# EAGLE design Nodo_actuador_doble (EAGLE 6.5.0)
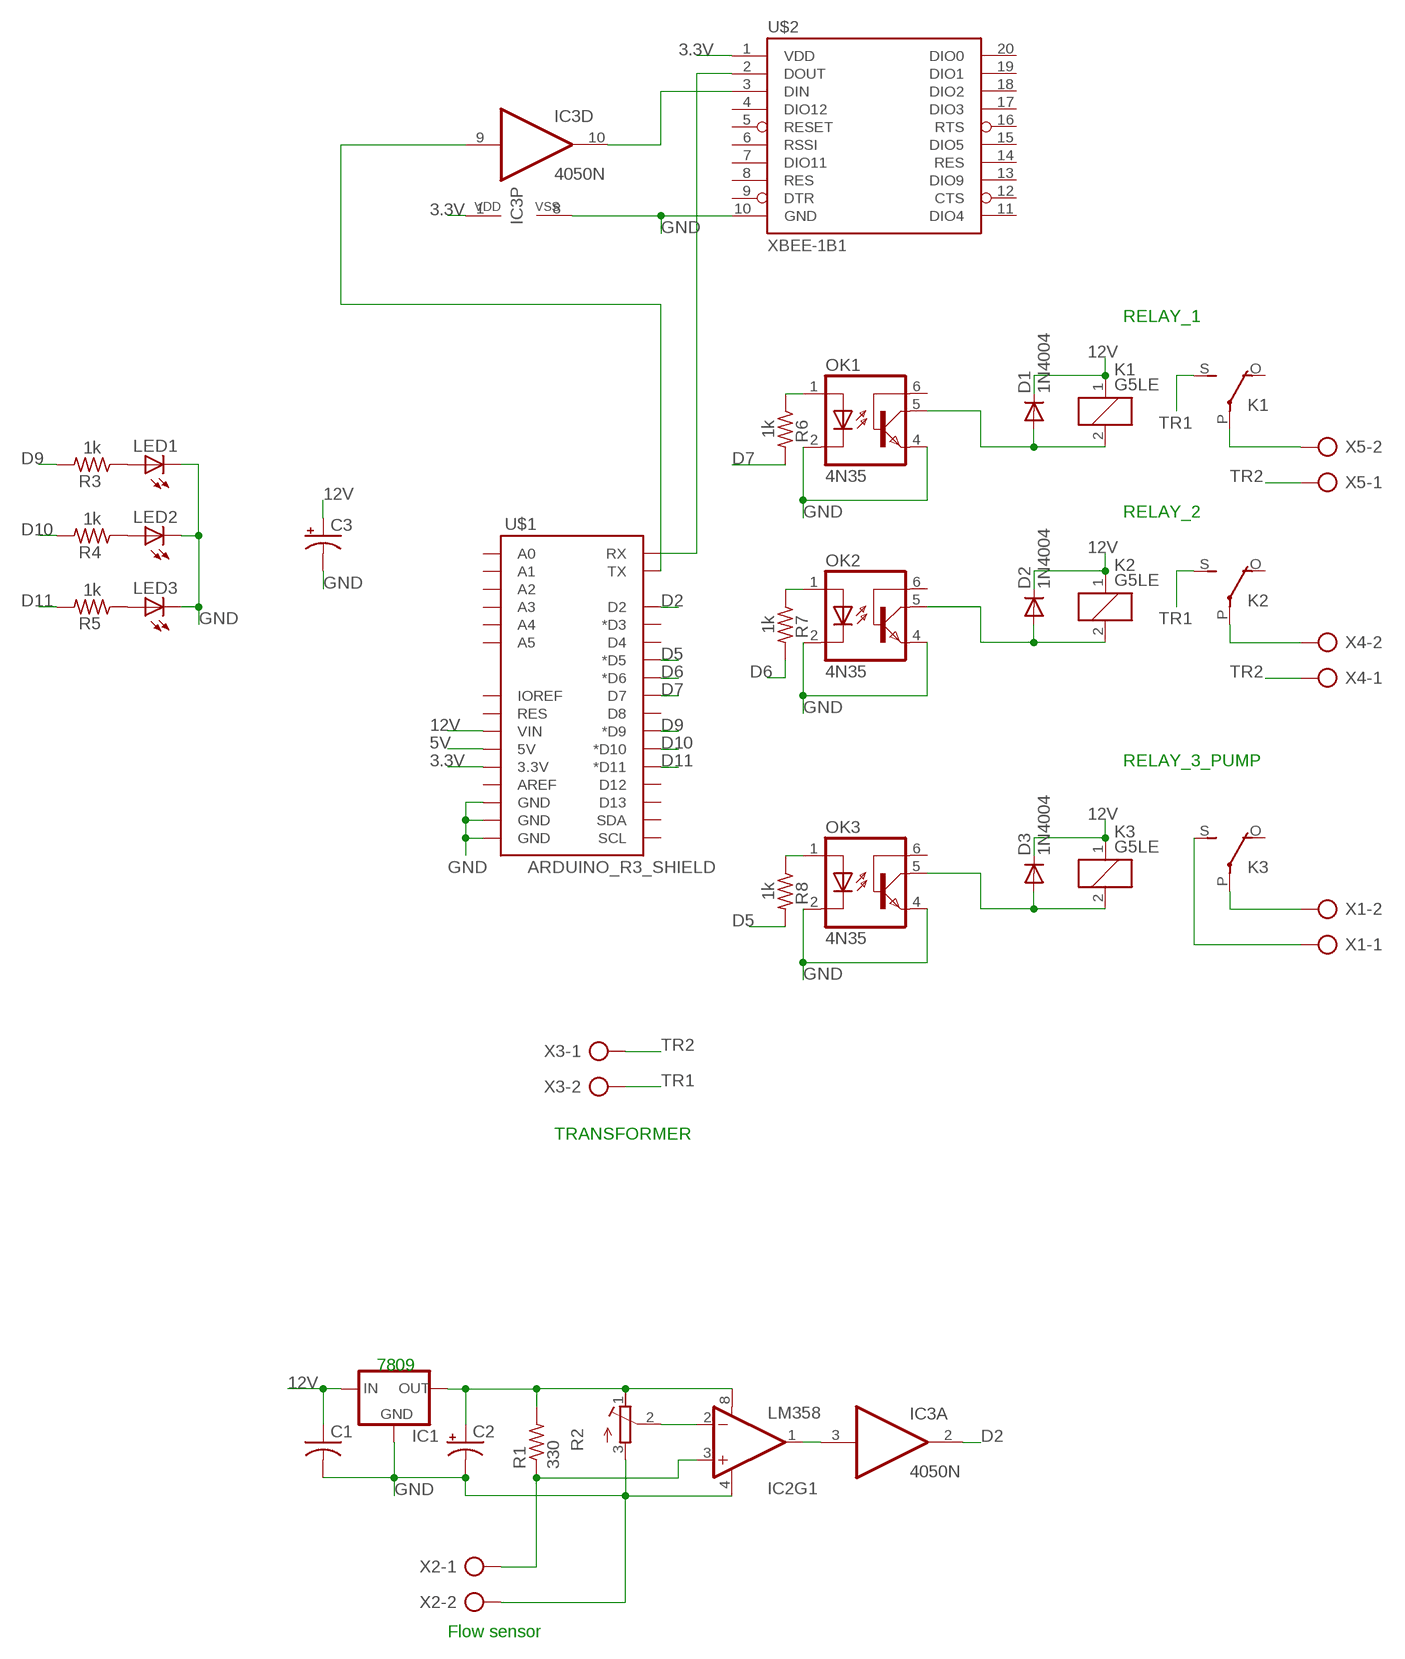
[diagram p0: schematic, sheet 1]

## Parts
C1  C-US050-024X044  [C050-024X044]
C2  CPOL-USE2.5-6  [E2,5-6]
C3  CPOL-USE2.5-6  [E2,5-6]
D1  1N4004  [DO41-10]
D2  1N4004  [DO41-10]
D3  1N4004  [DO41-10]
IC1  78XXS  [78XXS]
IC2  LM358  [DIP08]
IC3  4050N  [DIL16]
K1  G5LE  [G5LE]
K2  G5LE  [G5LE]
K3  G5LE  [G5LE]
LED1  LED3MM  [LED3MM]
LED2  LED3MM  [LED3MM]
LED3  LED3MM  [LED3MM]
OK1  4N35  [DIL06]
OK2  4N35  [DIL06]
OK3  4N35  [DIL06]
R1  330  R-US_0204/7  [0204/7]
R2  R-TRIMMT93YA  [RTRIMT93YA]
R3  1k  R-US_0204/7  [0204/7]
R4  1k  R-US_0204/7  [0204/7]
R5  1k  R-US_0204/7  [0204/7]
R6  1k  R-US_0204/7  [0204/7]
R7  1k  R-US_0204/7  [0204/7]
R8  1k  R-US_0204/7  [0204/7]
U$1  ARDUINO_R3_SHIELD  [UNO_R3_SHIELD]
U$2  XBEE-1B1  [XBEE-1]
X1  AK500/2  [AK500/2]
X2  AK500/2  [AK500/2]
X3  AK500/2  [AK500/2]
X4  AK500/2  [AK500/2]
X5  AK500/2  [AK500/2]

## Nets
3.3V: IC3.1(P:VDD) U$1.3.3V U$2.1(VDD)
5V: U$1.5V
12V: C1.1 C3.+ D1.C D2.C D3.C IC1.IN K1.1 K2.1 K3.1 U$1.VIN
D2: IC3.2(A:O) U$1.D2
D5: R8.2 U$1.D5(*D5)
D6: R7.2 U$1.D6(*D6)
D7: R6.2 U$1.D7
D9: R3.2 U$1.D9(*D9)
D10: R4.2 U$1.D10(*D10)
D11: R5.2 U$1.D11(*D11)
GND: C1.2 C2.- C3.- IC1.GND IC2.4(V-) IC3.8(P:VSS) LED1.K(C) LED2.K(C) LED3.K(C) OK1.2(C) OK1.4(EMI) OK2.2(C) OK2.4(EMI) OK3.2(C) OK3.4(EMI) R2.3(E) U$1.GND@0(GND) U$1.GND@1(GND) U$1.GND@2(GND) U$2.10(GND) X2.2
N$1: LED1.A R3.1
N$2: LED2.A R4.1
N$3: LED3.A R5.1
N$4: IC2.3(+IN) R1.1 X2.1
N$5: C2.+ IC1.OUT IC2.8(V+) R1.2 R2.1(A)
N$6: IC2.1(OUT) IC3.3(A:I)
N$7: IC2.2(-IN) R2.2(S)
N$10: K1.P(2:P) X5.2
N$11: D1.A K1.2 OK1.5(COL)
N$12: K2.P(2:P) X4.2
N$13: D2.A K2.2 OK2.5(COL)
N$14: U$1.RX U$2.2(DOUT)
N$15: IC3.9(D:I) U$1.TX
N$16: IC3.10(D:O) U$2.3(DIN)
N$18: D3.A K3.2 OK3.5(COL)
N$19: K3.P(2:P) X1.2
N$20: K3.S(2:S) X1.1
N$21: OK1.1(A) R6.1
N$22: OK2.1(A) R7.1
N$23: OK3.1(A) R8.1
TR1: K1.S(2:S) K2.S(2:S) X3.2
TR2: X3.1 X4.1 X5.1
Unconnected: IC2.5(+IN) IC2.6(-IN) IC2.7(OUT) IC3.4(B:O) IC3.5(B:I) IC3.6(C:O) IC3.7(C:I) IC3.11(E:I) IC3.12(E:O) IC3.14(F:I) IC3.15(F:O) K1.O(2:O) K2.O(2:O) K3.O(2:O) OK1.6(BAS) OK2.6(BAS) OK3.6(BAS) U$1.A0 U$1.A1 U$1.A2 U$1.A3 U$1.A4 U$1.A5 U$1.AREF U$1.D3(*D3) U$1.D4 U$1.D8 U$1.D12 U$1.D13 U$1.IOREF U$1.RES U$1.SCL U$1.SDA U$2.4(DIO12) U$2.5(RESET) U$2.6(RSSI) U$2.7(DIO11) U$2.8(RES) U$2.9(DTR) U$2.11(DIO4) U$2.12(CTS) U$2.13(DIO9) U$2.14(RES) U$2.15(DIO5) U$2.16(RTS) U$2.17(DIO3) U$2.18(DIO2) U$2.19(DIO1) U$2.20(DIO0)

## Notes on the sheet
- RELAY_1
- RELAY_2
- RELAY_3_PUMP
- TRANSFORMER
- 7809
- Flow sensor

## Library data of the parts
C1 = resistor:C-US: CAPACITOR, American symbol
C2 C3 = resistor:CPOL-US: POLARIZED CAPACITOR, American symbol
D1-D3 = diode:1N4004: DIODE general purpose rectifier, 1 A
IC1 = v-reg:78XXS: VOLTAGE REGULATOR
IC2 = SparkFun-AnalogIC:LM358: Jellybean op-amp; PROD_ID: IC-09172
IC3 = 40xx:4050: Hex non-inverting BUFFER
K1-K3 = relay:G5LE: RELAY 1 x switch, 10 A/120 V AC, 8 A/30 V DC, Omron; OC_FARNELL: unknown; OC_NEWARK: unknown
LED1-LED3 = led:LED: LED OSRAM: - CHIPLED LG R971, LG N971, LY N971, LG Q971, LY Q971, LO R971, LY R971 LH N974, LH R974 LS Q976, LO Q976, LY Q976 LO Q996 - Hyper CHIPLED LW Q18S LB Q993, LB Q99A, LB R99A - SideLED LS A670, LO A670, LY A670, LG A670, LP A670 LB A673, LV A673, LT A673, LW A673 LH A674 LY A675 LS A676, LA A676, LO A676, LY A676, LW A676 LS A679, LY A679, LG A679 - Hyper Micro SIDELED® LS Y876, LA Y876, LO Y876, LY Y876 LT Y87S - SmartLED LW L88C, LW L88S LB L89C, LB L89S, LG L890 LS L89K, LO L89K, LY L89K LS L896, LA L896, LO L896, LY L896 - TOPLED LS T670, LO T670, LY T670, LG T670, LP T670 LSG T670, LSP T670, LSY T670, LOP T670, LYG T670 LG T671, LOG T671, LSG T671 LB T673, LV T673, LT T673, LW T673 LH T674 LS T676, LA T676, LO T676, LY T676, LB T676, LH T676, LSB T676, LW T676 LB T67C, LV T67C, LT T67C, LS T67K, LO T67K, LY T67K, LW E67C LS E67B, LA E67B, LO E67B, LY E67B, LB E67C, LV E67C, LT E67C LW T67C LS T679, LY T679, LG T679 LS T770, LO T770, LY T770, LG T770, LP T770 LB T773, LV T773, LT T773, LW T773 LH T774 LS E675, LA E675, LY E675, LS T675 LS T776, LA T776, LO T776, LY T776, LB T776 LHGB T686 LT T68C, LB T68C - Hyper Mini TOPLED® LB M676 - Mini TOPLED Santana® LG M470 LS M47K, LO M47K, LY M47K Source: http://www.osram.convergy.de LUXEON: - LUMILED® LXK2-PW12-R00, LXK2-PW12-S00, LXK2-PW14-U00, LXK2-PW14-V00 LXK2-PM12-R00, LXK2-PM12-S00, LXK2-PM14-U00 LXK2-PE12-Q00, LXK2-PE12-R00, LXK2-PE12-S00, LXK2-PE14-T00, LXK2-PE14-U00 LXK2-PB12-K00, LXK2-PB12-L00, LXK2-PB12-M00, LXK2-PB14-N00, LXK2-PB14-P00, LXK2-PB14-Q00 LXK2-PR12-L00, LXK2-PR12-M00, LXK2-PR14-Q00, LXK2-PR14-R00 LXK2-PD12-Q00, LXK2-PD12-R00, LXK2-PD12-S00 LXK2-PH12-R00, LXK2-PH12-S00 LXK2-PL12-P00, LXK2-PL12-Q00, LXK2-PL12-R00 Source: www.luxeon.com KINGBRIGHT: KA-3528ASYC Source: www.kingbright.com
OK1-OK3 = optocoupler:4N35: MOTOROLA OPTO COUPLER; MF: FAIRCHILD SEMICONDUCTOR; MPN: 4N35; OC_FARNELL: 1328375; OC_NEWARK: 72K9946
R1 R3-R8 = resistor:R-US_: RESISTOR, American symbol
R2 = resistor:R-TRIMM: Trimm resistor
U$1 = SparkFun-Boards:ARDUINO_R3_SHIELD: Shield form compatible with the Arduino Uno R3.
U$2 = SparkFun-RF:XBEE-1: Xbee module footprints SMT header is CONN-09042.
X1-X5 = con-ptr500:AK500/2: CONNECTOR; OC_FARNELL: unknown; OC_NEWARK: unknown

## Board
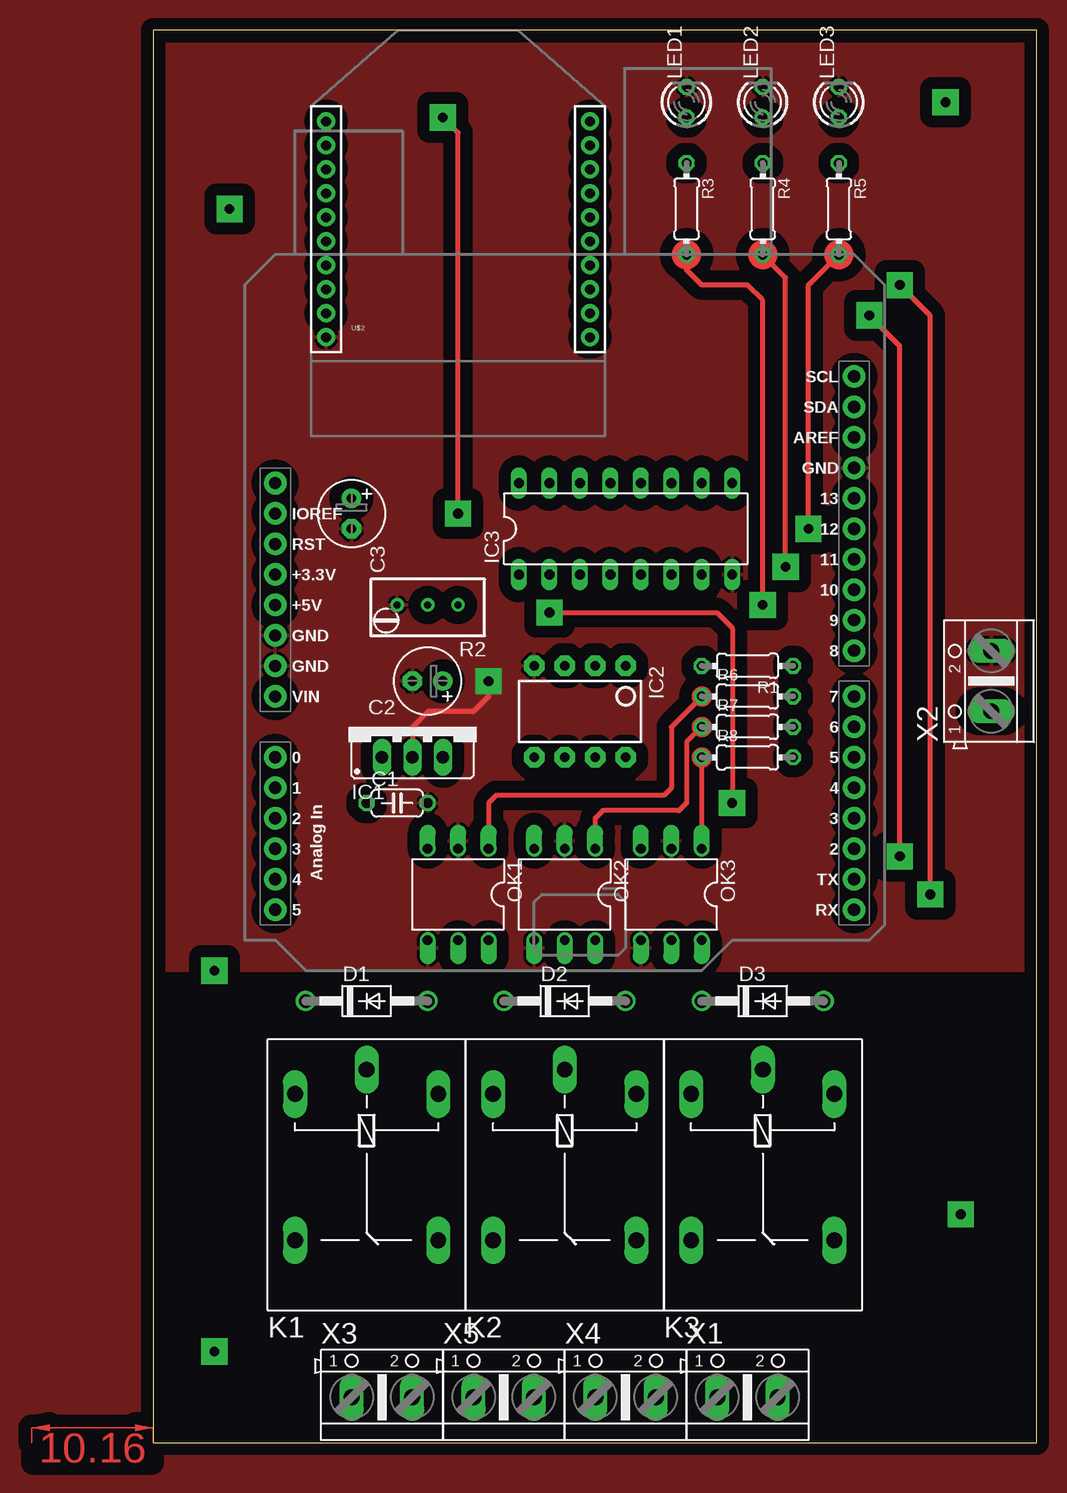
[diagram p1: board, top side]
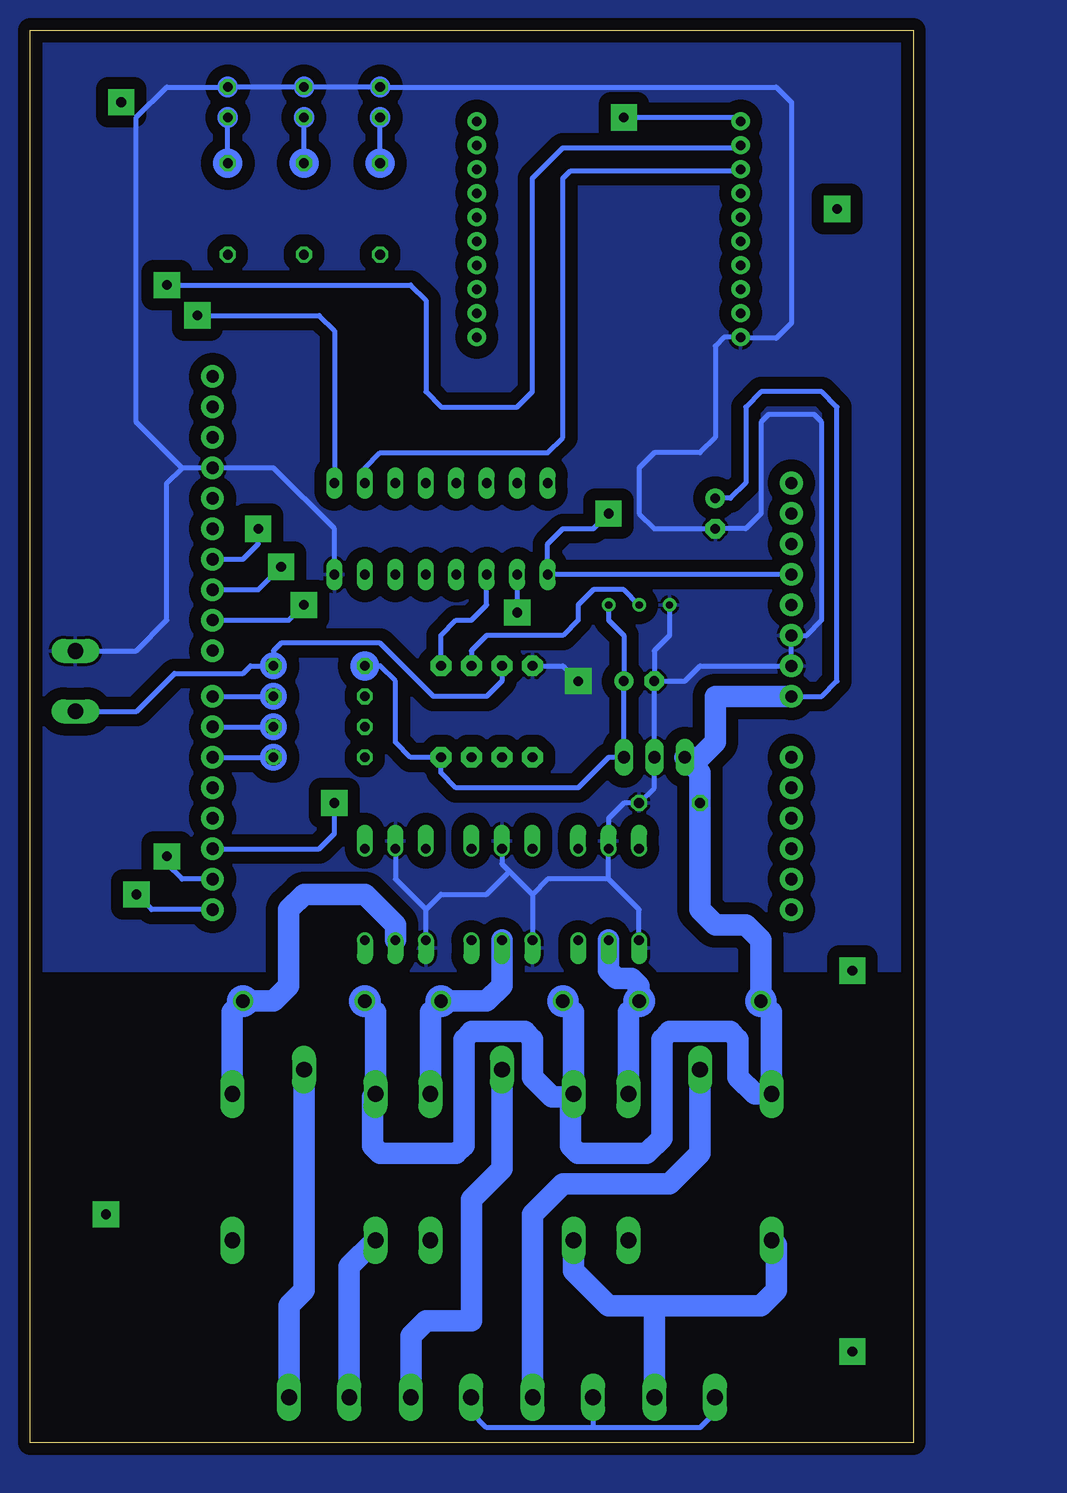
[diagram p2: board, bottom side, seen from below]

Size 73.64 x 117.78 mm. Coordinates in mm from the lower left corner, seen from the top.
Outline: 0,0 73.64,0 73.64,117.78 0,117.78 0,0
Copper layers (1*16): Top 0.035mm / dielectric 1.5mm / Bottom 0.035mm
Design rules "default": minimum track width 10mil, minimum drill 24mil, track to track 8mil, track to pad 8mil, pad to pad 8mil, via to via 8mil, smd to smd 8mil, copper to edge 40mil, drill to drill 8mil, minimum pad ring 10mil, minimum via ring 8mil, stop-mask expansion 4mil, vias tented up to drill 0mil, thermal gap 10mil

### Footprints (pad centres in the part's own frame; a part is rotated, then mirrored left to right if it is on the bottom)
C050-024X044 = drill 0.813 octagon: 1 -2.54,0; 2 2.54,0
E2,5-6 = drill 0.813 pad 1.6: + -1.27,0 | drill 0.813 pad 1.6 octagon: - 1.27,0
DO41-10 = drill 1.118: A 5.08,0; C -5.08,0
78XXS = drill 1.016 long: GND 0,-2.54; IN -2.54,-2.54; OUT 2.54,-2.54
DIP08 = drill 0.813 pad 1.727 octagon: 1 -3.81,-3.81; 2 -1.27,-3.81; 3 1.27,-3.81; 4 3.81,-3.81; 5 3.81,3.81; 6 1.27,3.81; 7 -1.27,3.81; 8 -3.81,3.81
DIL16 = drill 0.813 long: 1 -8.89,-3.81; 2 -6.35,-3.81; 3 -3.81,-3.81; 4 -1.27,-3.81; 5 1.27,-3.81; 6 3.81,-3.81; 7 6.35,-3.81; 8 8.89,-3.81; 9 8.89,3.81; 10 6.35,3.81; 11 3.81,3.81; 12 1.27,3.81; 13 -1.27,3.81; 14 -3.81,3.81; 15 -6.35,3.81; 16 -8.89,3.81
G5LE = drill 1.321 long: 1 -7.493,-5.969; 2 -7.493,5.969; O 4.699,5.969; P -9.525,0; S 4.699,-5.969
LED3MM = drill 0.813 octagon: A -1.27,0; K 1.27,0
DIL06 = drill 0.813 offset: 1 -2.54,-3.81; 2 0,-3.81; 3 2.54,-3.81; 4 2.54,3.81; 5 0,3.81; 6 -2.54,3.81
0204/7 = drill 0.813 octagon: 1 -3.81,0; 2 3.81,0
RTRIMT93YA = drill 0.61: 1 0,-2.54; 2 0,0; 3 0,2.54
UNO_R3_SHIELD = drill 1.016 pad 1.88: 3.3V 50.8,26.67; 5V 50.8,29.21; A0 50.8,41.91; A1 50.8,44.45; A2 50.8,46.99; A3 50.8,49.53; A4 50.8,52.07; A5 50.8,54.61; AREF 2.54,15.24; D2 2.54,49.53; D3 2.54,46.99; D4 2.54,44.45; D5 2.54,41.91; D6 2.54,39.37; D7 2.54,36.83; D8 2.54,33.02; D9 2.54,30.48; D10 2.54,27.94; D11 2.54,25.4; D12 2.54,22.86; D13 2.54,20.32; GND@0 50.8,31.75; GND@1 50.8,34.29; GND@2 2.54,17.78; IOREF 50.8,21.59; NC 50.8,19.05; RES 50.8,24.13; RX 2.54,54.61; SCL 2.54,10.16; SDA 2.54,12.7; TX 2.54,52.07; VIN 50.8,36.83
XBEE-1 = drill 0.8 pad 1.524: 1 -11,20; 2 -11,18; 3 -11,16; 4 -11,14; 5 -11,12; 6 -11,10; 7 -11,8; 8 -11,6; 9 -11,4; 10 -11,2; 11 11,2; 12 11,4; 13 11,6; 14 11,8; 15 11,10; 16 11,12; 17 11,14; 18 11,16; 19 11,18; 20 11,20
AK500/2 = drill 1.321 long: 1 -2.515,0; 2 2.515,0

### Placement (x,y rotation side)
C1  20.32,53.34 0 top
C2  22.86,63.5 180 top
C3  16.51,77.47 270 top
D1  17.78,36.83 0 top
D2  34.29,36.83 0 top
D3  50.8,36.83 0 top
IC1  21.59,59.69 0 top
IC2  35.56,60.96 180 top
IC3  39.37,76.2 0 top
K1  17.78,21.59 270 top
K2  34.29,21.59 270 top
K3  50.8,21.59 270 top
LED1  44.45,111.76 90 top
LED2  50.8,111.76 90 top
LED3  57.15,111.76 90 top
OK1  25.4,45.72 180 top
OK2  34.29,45.72 180 top
OK3  43.18,45.72 180 top
R1  49.53,64.77 180 top
R2  22.86,69.85 90 top
R3  44.45,102.87 270 top
R4  50.8,102.87 270 top
R5  57.15,102.87 270 top
R6  49.53,62.23 0 top
R7  49.53,59.69 0 top
R8  49.53,57.15 0 top
U$1  60.96,99.06 180 top
U$2  25.4,90.17 0 top
X1  49.53,3.81 0 top
X2  69.85,63.5 90 top
X3  19.05,3.81 0 top
X4  39.37,3.81 0 top
X5  29.21,3.81 0 top

### Tracks (layer width: path | path; a pad name or v marks a point on that pad's centre or on a via)
3.3V  (via drill 0.8 pad 2.18)
  Top 0.406: v25.4,77.47 25.4,109.22 v24.13,110.49
  Bottom 0.406: U$1.3.3V IC3.1 30.48,74.93 29.21,76.2 26.67,76.2 v25.4,77.47 | v24.13,110.49 14.72,110.49 U$2.1
12V
  Bottom 0.406: 45.09,28.83 K3.1 | K2.1 28.57,28.83 | U$1.VIN 7.62,62.23 6.35,63.5 6.35,86.36 7.62,87.63 12.7,87.63 13.97,86.36 13.97,80.01 15.24,78.74 C3.+
  Bottom 1.778: D3.C 44.83,35.94 K3.1 | 45.09,28.83 45.09,24.77 44.45,24.13 38.1,24.13 37.46,24.77 37.46,33.66 36.83,34.29 32.38,34.29 31.75,33.66 31.75,30.48 30.1,28.83 28.57,28.83 28.57,24.77 27.94,24.13 22.23,24.13 20.96,25.4 20.96,33.66 20.32,34.29 15.24,34.29 14.6,33.66 14.6,30.48 13.21,29.08 K1.1 11.81,35.94 D1.C 12.7,41.91 13.97,43.18 16.51,43.18 17.78,44.45 C1.1 17.78,55.88 IC1.IN 17.78,57.15 16.51,58.42 16.51,62.23 U$1.VIN | D2.C 28.32,35.94 K2.1
D2  (via drill 0.8 pad 2.18)
  Top 0.406: v33.02,69.22 46.99,69.22 48.26,67.94 v48.26,53.34
  Bottom 0.406: IC3.2 v33.02,69.22 | U$1.D2 49.53,49.53 48.26,50.8 v48.26,53.34
D5
  Bottom 0.406: U$1.D5 R8.2
D6
  Bottom 0.406: U$1.D6 R7.2
D7
  Bottom 0.406: U$1.D7 R6.2
D9  (via drill 0.8 pad 2.18)
  Top 0.406: v50.8,69.85 50.8,95.25 49.53,96.52 45.72,96.52 44.45,97.79 R3.2
  Bottom 0.406: U$1.D9 52.07,68.58 v50.8,69.85
D10  (via drill 0.8 pad 2.18)
  Top 0.406: v52.7,73.03 52.7,97.16 R4.2
  Bottom 0.406: U$1.D10 54.61,71.12 v52.7,73.03
D11  (via drill 0.8 pad 2.18)
  Top 0.406: v54.61,76.2 54.61,96.52 R5.2
  Bottom 0.406: U$1.D11 55.88,73.66 54.61,74.93 v54.61,76.2
GND  (via drill 0.8 pad 2.18)
  Top 0.406: v27.94,63.5 27.94,62.23 26.67,60.96 22.86,60.96 21.59,59.69 IC1.GND
  Bottom 0.406: OK1.4 22.86,44.45 25.4,46.99 | 25.4,46.99 OK1.2 25.4,52.07 24.13,53.34 C1.2 21.59,54.61 IC1.GND C2.- | 25.4,46.99 30.48,46.99 31.75,45.72 | 31.75,45.72 OK2.4 | OK2.2 34.29,48.26 33.66,47.62 | 33.66,47.62 31.75,45.72 | OK3.4 40.64,44.45 | 40.64,44.45 39.37,45.72 35.56,45.72 33.66,47.62 | OK3.2 43.18,46.99 40.64,44.45 | C2.- 19.05,63.5 17.78,64.77 U$1.GND@1 U$1.GND@0 8.89,67.31 7.62,68.58 7.62,85.09 8.25,85.72 12.06,85.72 12.7,85.09 12.7,77.47 13.97,76.2 C3.- 21.59,76.2 22.86,77.47 22.86,81.28 21.59,82.55 17.78,82.55 16.51,83.82 16.51,91.44 15.78,92.17 U$2.10 14.3,92.08 11.43,92.08 10.16,93.34 10.16,111.76 11.43,113.03 LED1.K LED2.K LED3.K 62.23,113.03 64.77,110.49 64.77,85.09 60.96,81.28 | R2.3 20.32,67.31 21.59,66.04 C2.- | X2.2 64.8,66.02 62.23,68.58 62.23,80.01 60.96,81.28 | IC2.4 29.21,64.77 v27.94,63.5 | 60.96,81.28 U$1.GND@2 53.34,81.28 48.26,76.2 IC3.8
  pour Top (isolate 1.016): 0,39.37 73.66,39.37 73.66,118.11 0,118.11
  pour Bottom (isolate 1.016): 0,39.37 73.66,39.37 73.66,118.11 0,118.11
N$1
  Bottom 0.406: R3.1 LED1.A
N$2
  Bottom 0.406: R4.1 LED2.A
N$3
  Bottom 0.406: R5.1 LED3.A
N$4
  Bottom 0.406: X2.1 64.75,60.98 61.59,64.13 55.88,64.13 55.24,64.77 R1.1 53.34,66.04 52.7,66.68 44.45,66.68 40,62.23 35.56,62.23 34.29,63.5 IC2.3
N$5
  Bottom 0.406: R2.1 25.4,68.58 24.13,67.31 C2.+ IC1.OUT 25.4,57.15 27.94,54.61 38.1,54.61 39.37,55.88 IC2.8 41.91,57.15 43.18,58.42 43.18,63.5 44.45,64.77 R1.2
N$6
  Bottom 0.406: IC2.1 39.37,67.31 38.1,68.58 36.83,68.58 35.56,69.85 IC3.3
N$7
  Bottom 0.406: R2.2 24.13,71.12 26.67,71.12 27.94,69.85 27.94,68.58 29.21,67.31 35.56,67.31 36.83,66.04 IC2.2
N$8  (via drill 0.8 pad 2.18)
  other vias: 6.35,102.87
N$9  (via drill 0.8 pad 2.18)
  other vias: 66.04,111.76
N$10
  Bottom 0.406: 31.75,3.84 X5.2
  Bottom 1.778: K1.P 17.78,24.13 20.32,21.59 29.21,21.59 31.75,19.05 31.75,3.84
N$11
  Bottom 1.778: K1.2 23.75,35.94 D1.A 22.86,38.1 23.5,38.73 24.77,38.73 25.4,39.37 OK1.5
N$12
  Bottom 1.778: X4.2 41.88,8.92 40.64,10.16 36.83,10.16 36.83,20.32 34.29,22.86 K2.P
N$13
  Bottom 1.778: K2.2 40.26,35.94 D2.A 35.56,36.83 34.29,38.1 OK2.5
N$14  (via drill 0.8 pad 2.18)
  Top 0.406: v64.77,45.72 64.77,93.98 v62.23,96.52
  Bottom 0.406: U$1.RX 63.5,44.45 v64.77,45.72 | v62.23,96.52 41.91,96.52 40.64,95.25 40.64,87.63 39.37,86.36 33.02,86.36 31.75,87.63 31.75,105.41 29.21,107.95 14.62,107.95 U$2.2
N$15  (via drill 0.8 pad 2.18)
  Top 0.406: v62.23,48.89 62.23,91.44 v59.69,93.98
  Bottom 0.406: v59.69,93.98 49.53,93.98 48.26,92.71 IC3.9 | U$1.TX 60.96,46.99 62.23,48.26 v62.23,48.89
N$16
  Bottom 0.406: IC3.10 45.72,81.28 44.45,82.55 30.48,82.55 29.21,83.82 29.21,105.41 28.57,106.05 14.53,106.05 U$2.3
N$17  (via drill 0.8 pad 2.18)
  other vias: 67.31,19.05
N$18
  Bottom 1.778: K3.2 56.77,35.94 D3.A 53.34,36.83 52.07,38.1 52.07,44.45 50.8,45.72 45.72,45.72 43.18,43.18 OK3.5
N$19
  Bottom 1.778: K3.P 50.8,12.7 52.04,11.46 X1.2
N$20
  Bottom 1.778: K3.S 47.02,14.71 X1.1
N$21
  Top 0.406: R6.1 43.18,59.69 43.18,54.61 42.54,53.98 28.57,53.98 27.94,53.34 OK1.1
N$22
  Top 0.406: R7.1 44.45,58.42 44.45,53.34 43.81,52.7 37.46,52.7 36.83,52.07 OK2.1
N$23
  Top 0.406: OK3.1 R8.1
N$24  (via drill 0.8 pad 2.18)
  other vias: 5.08,7.62
N$25  (via drill 0.8 pad 2.18)
  other vias: 5.08,39.37
N$26
  pour Top (isolate 1.016): 43.18,149.86 139.7,149.86 139.7,60.96 73.66,60.96 73.66,118.11 0,118.11 0,57.15 -59.69,57.15 -59.69,149.86 33.02,149.86 33.02,143.51 41.91,143.51 41.91,149.86
  pour Bottom (isolate 1.016): 41.91,149.86 139.7,149.86 139.7,60.96 73.66,60.96 73.66,118.11 0,118.11 0,57.15 -59.69,57.15 -59.69,149.86 33.02,149.86 33.02,143.51 41.91,143.51
N$27
  pour Top (isolate 1.016): -59.69,57.15 -59.69,-71.12 36.83,-71.12 36.83,-64.77 45.72,-64.77 45.72,-71.12 52.07,-71.12 139.7,-71.12 139.7,52.07 133.35,52.07 133.35,60.96 73.66,60.96 73.66,0 0,0 0,57.15
  pour Bottom (isolate 1.016): -59.69,57.15 -59.69,-71.12 36.83,-71.12 36.83,-64.77 45.72,-64.77 45.72,-71.12 139.7,-71.12 139.7,52.07 133.35,52.07 133.35,60.96 73.66,60.96 73.66,0 0,0 0,57.15
N$28
  pour Top (isolate 1.016): -81.28,63.5 -81.28,165.1 33.02,165.1 33.02,158.75 26.67,158.75 26.67,149.86 -59.69,149.86 -59.69,63.5 -66.04,63.5 -66.04,69.85 -74.93,69.85 -74.93,63.5
  pour Bottom (isolate 1.016): -81.28,63.5 -81.28,165.1 33.02,165.1 33.02,158.75 26.67,158.75 26.67,149.86 -59.69,149.86 -59.69,63.5 -66.04,63.5 -66.04,69.85 -74.93,69.85 -74.93,63.5
N$29
  pour Top (isolate 1.016): 41.91,165.1 154.94,165.1 154.94,60.96 148.59,60.96 148.59,67.31 139.7,67.31 139.7,149.86 48.26,149.86 48.26,158.75 41.91,158.75
  pour Bottom (isolate 1.016): 41.91,165.1 154.94,165.1 154.94,60.96 148.59,60.96 148.59,67.31 139.7,67.31 139.7,149.86 48.26,149.86 48.26,158.75 41.91,158.75
N$30
  pour Top (isolate 1.016): -81.28,54.61 -74.93,54.61 -74.93,48.26 -66.04,48.26 -66.04,54.61 -59.69,54.61 -59.69,-71.12 30.48,-71.12 30.48,-80.01 36.83,-80.01 36.83,-86.36 -81.28,-86.36
  pour Bottom (isolate 1.016): -81.28,54.61 -74.93,54.61 -74.93,48.26 -66.04,48.26 -66.04,54.61 -59.69,54.61 -59.69,-71.12 30.48,-71.12 30.48,-80.01 36.83,-80.01 36.83,-86.36 -81.28,-86.36
N$31
  pour Top (isolate 1.016): 154.94,52.07 148.59,52.07 148.59,45.72 139.7,45.72 139.7,-71.12 52.07,-71.12 52.07,-80.01 45.72,-80.01 45.72,-86.36 154.94,-86.36
  pour Bottom (isolate 1.016): 154.94,52.07 148.59,52.07 148.59,45.72 139.7,45.72 139.7,-71.12 52.07,-71.12 52.07,-80.01 45.72,-80.01 45.72,-86.36 154.94,-86.36
TR1
  Bottom 0.406: 21.57,11.41 21.59,11.43
  Bottom 1.778: K2.S 28.32,14.35 25.4,11.43 21.59,11.43 12.7,11.43 11.43,12.7 11.43,16.51 K1.S | X3.2 21.57,11.41
TR2
  Bottom 0.406: X3.1 16.54,2.52 17.78,1.27 26.67,1.27 | 26.67,1.27 35.56,1.27 36.83,2.54 36.83,3.79 X4.1 | X5.1 26.7,1.3 26.67,1.27
(copper drawn outside any net)
  shapes: Bottom area x48, Bottom circle x20, Top area x49, Top circle x6